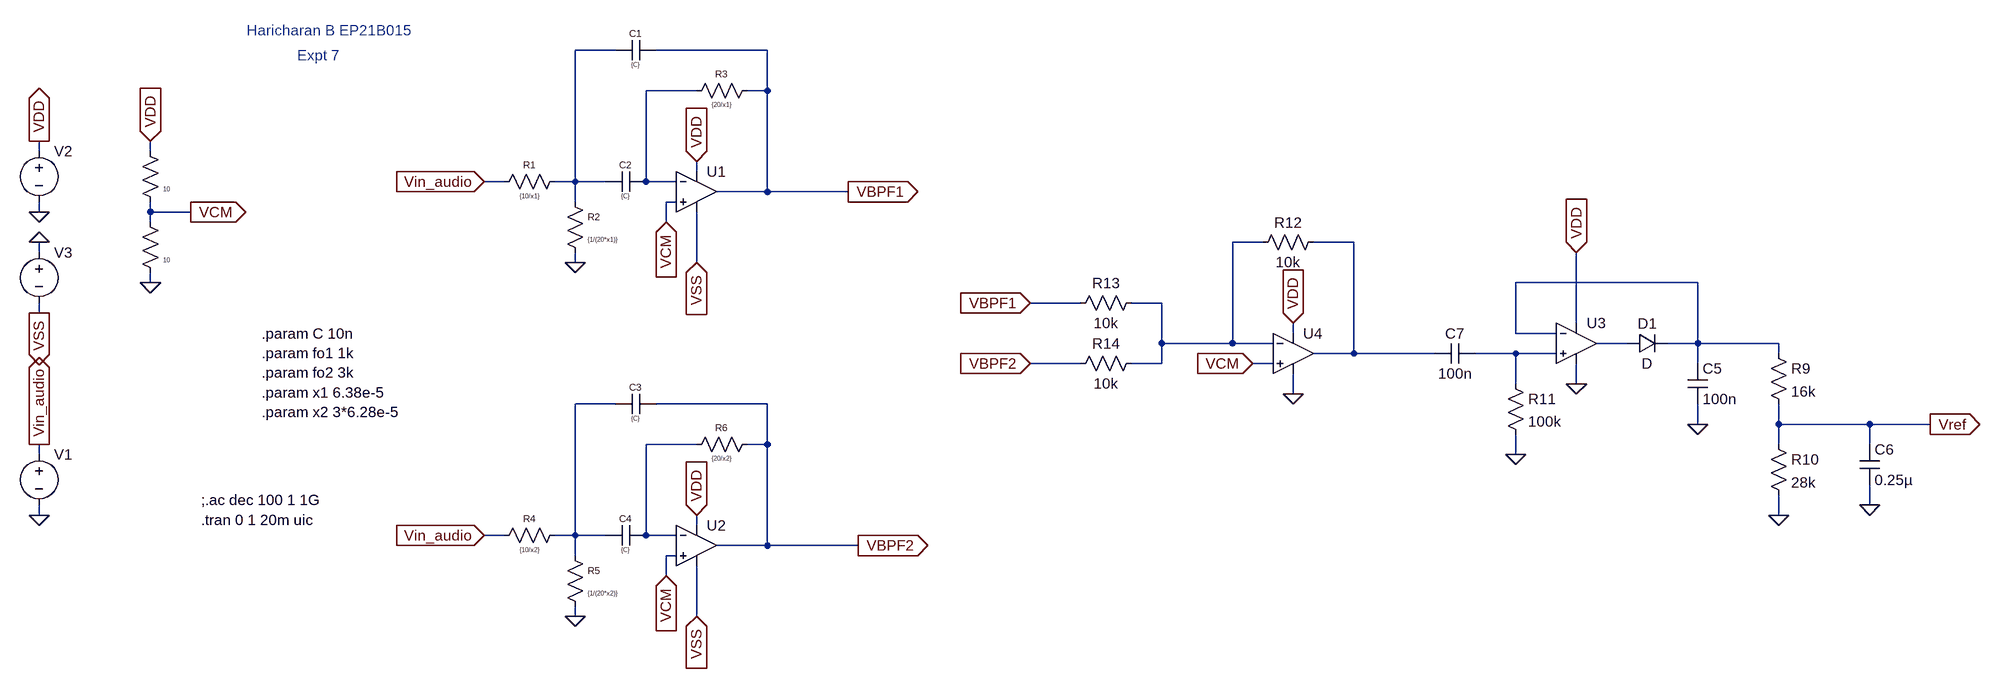
[diagram p0: schematic lab_expt_7.asc]
lab_expt_7.asc, the LTspice schematic file:
Version 4
SHEET 1 4812 1308
WIRE 2624 224 2560 224
WIRE 2864 224 2688 224
WIRE 2752 288 2672 288
WIRE 2864 288 2864 224
WIRE 2864 288 2832 288
WIRE 1712 384 1712 368
WIRE 1888 384 1888 368
WIRE 2752 416 2752 400
WIRE 2448 432 2416 432
WIRE 2560 432 2560 224
WIRE 2560 432 2528 432
WIRE 2608 432 2560 432
WIRE 2672 432 2672 288
WIRE 2720 432 2672 432
WIRE 2864 448 2864 288
WIRE 2864 448 2784 448
WIRE 2992 448 2864 448
WIRE 2560 464 2560 432
WIRE 2720 464 2704 464
WIRE 1712 480 1712 464
WIRE 1888 480 1888 464
WIRE 1952 480 1888 480
WIRE 1888 496 1888 480
WIRE 2704 496 2704 464
WIRE 3648 528 3600 528
WIRE 3792 528 3728 528
WIRE 1712 544 1712 528
WIRE 2560 560 2560 544
WIRE 2752 560 2752 480
WIRE 1888 592 1888 576
WIRE 4336 592 4048 592
WIRE 3360 624 3280 624
WIRE 3488 624 3440 624
WIRE 1712 640 1712 624
WIRE 4144 656 4144 544
WIRE 3696 672 3696 656
WIRE 4048 672 4048 592
WIRE 4112 672 4048 672
WIRE 3488 688 3488 624
WIRE 3600 688 3600 528
WIRE 3600 688 3488 688
WIRE 3664 688 3600 688
WIRE 4224 688 4176 688
WIRE 4336 688 4336 592
WIRE 4336 688 4288 688
WIRE 4464 688 4336 688
WIRE 3792 704 3792 528
WIRE 3792 704 3728 704
WIRE 3920 704 3792 704
WIRE 4048 704 3984 704
WIRE 4112 704 4048 704
WIRE 4464 704 4464 688
WIRE 3360 720 3280 720
WIRE 3488 720 3488 688
WIRE 3488 720 3440 720
WIRE 3664 720 3632 720
WIRE 4336 720 4336 688
WIRE 4048 752 4048 704
WIRE 4144 752 4144 720
WIRE 3696 768 3696 736
WIRE 2624 784 2560 784
WIRE 2864 784 2688 784
WIRE 4336 816 4336 784
WIRE 4464 816 4464 784
WIRE 4608 816 4464 816
WIRE 4704 816 4608 816
WIRE 2752 848 2672 848
WIRE 2864 848 2864 784
WIRE 2864 848 2832 848
WIRE 4464 848 4464 816
WIRE 4608 848 4608 816
WIRE 1712 864 1712 848
WIRE 4048 864 4048 832
WIRE 4608 944 4608 912
WIRE 1712 960 1712 944
WIRE 4464 960 4464 928
WIRE 2752 976 2752 960
WIRE 2448 992 2416 992
WIRE 2560 992 2560 784
WIRE 2560 992 2528 992
WIRE 2608 992 2560 992
WIRE 2672 992 2672 848
WIRE 2720 992 2672 992
WIRE 2864 1008 2864 848
WIRE 2864 1008 2784 1008
WIRE 3008 1008 2864 1008
WIRE 2560 1024 2560 992
WIRE 2720 1024 2704 1024
WIRE 2704 1056 2704 1024
WIRE 2560 1120 2560 1104
WIRE 2752 1120 2752 1040
FLAG 2560 560 0
FLAG 2752 560 VSS
IOPIN 2752 560 In
FLAG 2752 400 VDD
IOPIN 2752 400 In
FLAG 2416 432 Vin_audio
IOPIN 2416 432 In
FLAG 1712 848 Vin_audio
IOPIN 1712 848 Out
FLAG 1712 960 0
FLAG 1712 480 0
FLAG 1712 368 VDD
IOPIN 1712 368 Out
FLAG 1712 528 0
FLAG 1712 640 VSS
IOPIN 1712 640 Out
FLAG 2560 1120 0
FLAG 2752 1120 VSS
IOPIN 2752 1120 In
FLAG 2752 960 VDD
IOPIN 2752 960 In
FLAG 2416 992 Vin_audio
IOPIN 2416 992 In
FLAG 1888 592 0
FLAG 1888 368 VDD
IOPIN 1888 368 In
FLAG 1952 480 VCM
IOPIN 1952 480 Out
FLAG 2704 496 VCM
IOPIN 2704 496 In
FLAG 2704 1056 VCM
IOPIN 2704 1056 In
FLAG 3008 1008 VBPF2
IOPIN 3008 1008 Out
FLAG 2992 448 VBPF1
IOPIN 2992 448 Out
FLAG 4144 752 0
FLAG 4144 544 VDD
IOPIN 4144 544 In
FLAG 4336 816 0
FLAG 4464 960 0
FLAG 4608 944 0
FLAG 4048 864 0
FLAG 3696 656 VDD
IOPIN 3696 656 In
FLAG 3696 768 0
FLAG 3632 720 VCM
IOPIN 3632 720 In
FLAG 3280 624 VBPF1
IOPIN 3280 624 In
FLAG 3280 720 VBPF2
IOPIN 3280 720 In
FLAG 4704 816 Vref
IOPIN 4704 816 Out
SYMBOL res 2544 416 R90
WINDOW 0 0 56 VBottom 1
WINDOW 3 32 56 VTop 0
SYMATTR InstName R1
SYMATTR Value {10/x1}
SYMBOL res 2544 448 R0
WINDOW 0 36 40 Left 1
WINDOW 3 36 76 Left 0
SYMATTR InstName R2
SYMATTR Value {1/(20*x1)}
SYMBOL res 2736 304 R270
WINDOW 0 32 56 VTop 1
WINDOW 3 0 56 VBottom 0
SYMATTR InstName R3
SYMATTR Value {20/x1}
SYMBOL cap 2688 208 R90
WINDOW 0 0 32 VBottom 1
WINDOW 3 32 32 VTop 0
SYMATTR InstName C1
SYMATTR Value {C}
SYMBOL cap 2672 416 R90
WINDOW 0 0 32 VBottom 1
WINDOW 3 32 32 VTop 0
SYMATTR InstName C2
SYMATTR Value {C}
SYMBOL voltage 1712 848 R0
WINDOW 3 82 38 Invisible 1
WINDOW 39 0 0 Left 0
SYMATTR Value SINE(0 0.45 1k)
SYMATTR InstName V1
SYMATTR Value2 AC 1 0
SYMBOL voltage 1712 368 R0
WINDOW 3 24 96 Invisible 2
SYMATTR Value 5
SYMATTR InstName V2
SYMBOL voltage 1712 528 R0
WINDOW 3 24 96 Invisible 2
SYMATTR Value 5
SYMATTR InstName V3
SYMBOL res 2544 976 R90
WINDOW 0 0 56 VBottom 1
WINDOW 3 32 56 VTop 0
SYMATTR InstName R4
SYMATTR Value {10/x2}
SYMBOL res 2544 1008 R0
WINDOW 0 36 40 Left 1
WINDOW 3 36 76 Left 0
SYMATTR InstName R5
SYMATTR Value {1/(20*x2)}
SYMBOL res 2736 864 R270
WINDOW 0 32 56 VTop 1
WINDOW 3 0 56 VBottom 0
SYMATTR InstName R6
SYMATTR Value {20/x2}
SYMBOL cap 2688 768 R90
WINDOW 0 0 32 VBottom 1
WINDOW 3 32 32 VTop 0
SYMATTR InstName C3
SYMATTR Value {C}
SYMBOL cap 2672 976 R90
WINDOW 0 0 32 VBottom 1
WINDOW 3 32 32 VTop 0
SYMATTR InstName C4
SYMATTR Value {C}
SYMBOL res 1872 368 R0
WINDOW 0 36 40 Invisible 2
WINDOW 3 36 76 Left 0
SYMATTR InstName R7
SYMATTR Value 10
SYMBOL res 1872 480 R0
WINDOW 0 36 40 Invisible 2
WINDOW 3 36 76 Left 0
SYMATTR InstName R8
SYMATTR Value 10
SYMBOL OpAmps\\UniversalOpAmp 2752 448 R0
SYMATTR InstName U1
SYMBOL OpAmps\\UniversalOpAmp 2752 1008 R0
SYMATTR InstName U2
SYMBOL diode 4224 704 R270
WINDOW 0 32 32 VTop 2
WINDOW 3 0 32 VBottom 2
SYMATTR InstName D1
SYMBOL cap 4320 720 R0
SYMATTR InstName C5
SYMATTR Value 100n
SYMBOL res 4448 688 R0
SYMATTR InstName R9
SYMATTR Value 16k
SYMBOL res 4448 832 R0
SYMATTR InstName R10
SYMATTR Value 28k
SYMBOL cap 4592 848 R0
SYMATTR InstName C6
SYMATTR Value 0.25µ
SYMBOL OpAmps\\UniversalOpAmp2 4144 688 R0
SYMATTR InstName U3
SYMBOL OpAmps\\UniversalOpAmp 3696 704 R0
SYMATTR InstName U4
SYMBOL cap 3984 688 R90
WINDOW 0 0 32 VBottom 2
WINDOW 3 32 32 VTop 2
SYMATTR InstName C7
SYMATTR Value 100n
SYMBOL res 4032 736 R0
SYMATTR InstName R11
SYMATTR Value 100k
SYMBOL res 3744 512 R90
WINDOW 0 0 56 VBottom 2
WINDOW 3 32 56 VTop 2
SYMATTR InstName R12
SYMATTR Value 10k
SYMBOL res 3456 608 R90
WINDOW 0 0 56 VBottom 2
WINDOW 3 32 56 VTop 2
SYMATTR InstName R13
SYMATTR Value 10k
SYMBOL res 3456 704 R90
WINDOW 0 0 56 VBottom 2
WINDOW 3 32 56 VTop 2
SYMATTR InstName R14
SYMATTR Value 10k
TEXT 1968 936 Left 2 !;.ac dec 100 1 1G\n.tran 0 1 20m uic
TEXT 2064 672 Left 2 !.param C 10n\n.param fo1 1k\n.param fo2 3k\n.param x1 6.38e-5\n.param x2 3*6.28e-5
TEXT 2040 192 Left 2 ;Haricharan B EP21B015
TEXT 2120 232 Left 2 ;Expt 7

The netlist it stands for:
* lab_expt_7.asc
R1 N001 Vin_audio {10/x1}
R2 N001 0 {1/(20*x1)}
R3 N002 VBPF1 {20/x1}
C1 VBPF1 N001 {C}
C2 N002 N001 {C}
V1 Vin_audio 0 SINE(0 0.45 1k) AC 1 0
V2 VDD 0 5
V3 0 VSS 5
R4 N008 Vin_audio {10/x2}
R5 N008 0 {1/(20*x2)}
R6 N009 VBPF2 {20/x2}
C3 VBPF2 N008 {C}
C4 N009 N008 {C}
R7 VDD VCM 10
R8 VCM 0 10
XU1 VCM N002 VDD VSS VBPF1 level1 Avol=1Meg GBW=10Meg Vos=0 En=0 Enk=0 In=0 Ink=0 Rin=500Meg  ; pins In+ In- V+ V- OUT
XU2 VCM N009 VDD VSS VBPF2 level1 Avol=1Meg GBW=10Meg Vos=0 En=0 Enk=0 In=0 Ink=0 Rin=500Meg  ; pins In+ In- V+ V- OUT
D1 N006 N005 D
C5 N005 0 100n
R9 N005 Vref 16k
R10 Vref 0 28k
C6 Vref 0 0.25µ
XU3 N007 N005 VDD 0 N006 level2 Avol=1Meg GBW=10Meg Slew=10Meg Ilimit=25m Rail=0 Vos=0 En=0 Enk=0 In=0 Ink=0 Rin=500Meg  ; pins In+ In- V+ V- OUT
XU4 VCM N003 VDD 0 N004 level1 Avol=1Meg GBW=10Meg Vos=0 En=0 Enk=0 In=0 Ink=0 Rin=500Meg  ; pins In+ In- V+ V- OUT
C7 N007 N004 100n
R11 N007 0 100k
R12 N004 N003 10k
R13 N003 VBPF1 10k
R14 N003 VBPF2 10k
.model D D
.lib standard.dio
;.ac dec 100 1 1G
.tran 0 1 20m uic
.param C 10n
.param fo1 1k
.param fo2 3k
.param x1 6.38e-5
.param x2 3*6.28e-5
* Haricharan B EP21B015
* Expt 7
.lib UniversalOpAmp1.lib
.lib UniversalOpAmp2.lib
.backanno
.end